# Altium schematic sheet Battery Protection.SchDoc
size A4; SheetNumber: 5; SheetTotal: 6
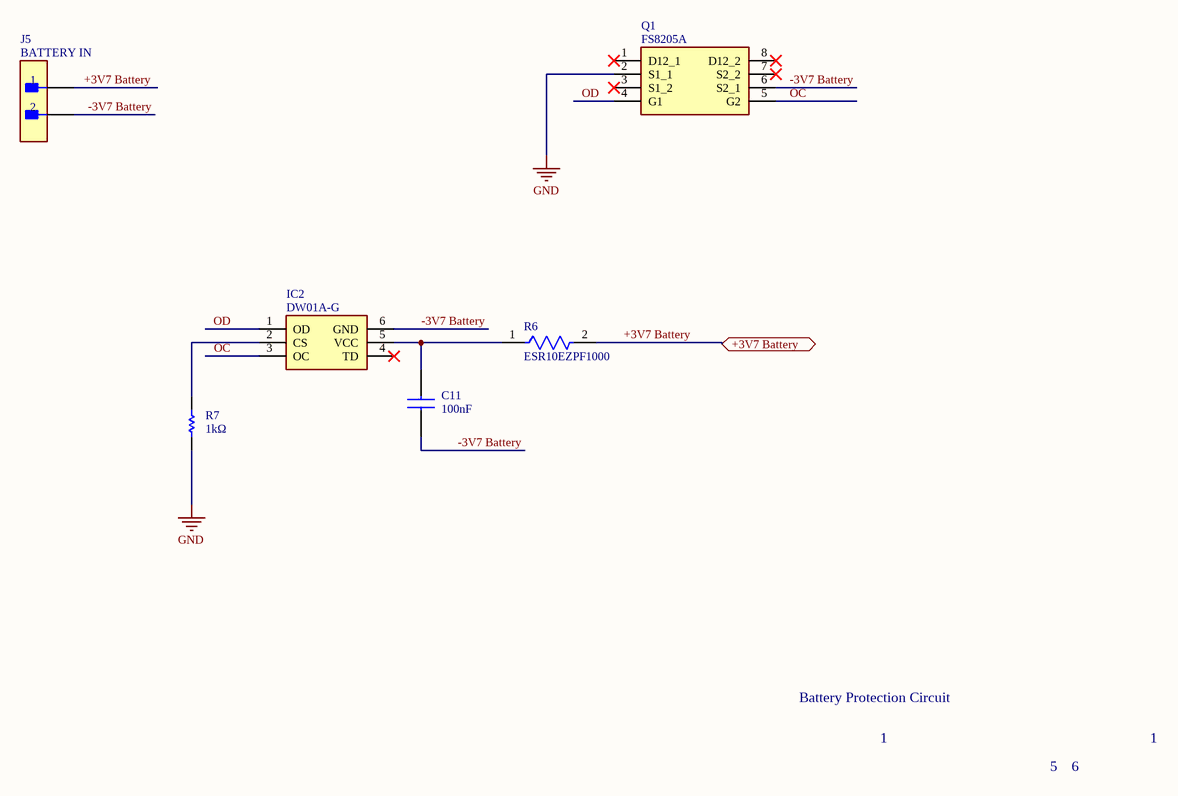
[diagram p0: Battery Protection.SchDoc]

## Parts
C11  value 100nF  [CAPC2013X137N]  (hidden comment: 0805B104K500NT)
IC2  DW01A-G  [SOT95P280X135-6N]
J5  BATTERY IN  [FP-B2B-EH-A_LF_SN-MFG]
Q1  FS8205A  [SOP65P640X120-8N]
R6  ESR10EZPF1000  [FP-ESR10-IPC_C]
R7  value 1kΩ  [RESC2013X60X30ML20T20]  (hidden comment: RK73B2ATTD102J)

## Ports
+3V7 Battery (bidir, see Encode Schematic[1B], Battery Charger[3C], Voltage Regulator[2B])

## Nets
GND: Q1.2(S1_1) R7.1
+3V7 Battery: J5.1 R6.2 ; port +3V7 Battery
-3V7 Battery: C11.2 IC2.6(GND) J5.2 Q1.6(S2_1)
OC: IC2.3(OC) Q1.5(G2)
OD: IC2.1(OD) Q1.4(G1)
NetC11_1: C11.1 IC2.5(VCC) R6.1
NetIC2_2: IC2.2(CS) R7.2

Not connected (* = marked no-connect by the designer): IC2 4(TD)*; Q1 1(D12_1)* 3(S1_2)* 7(S2_2)* 8(D12_2)*

## Notes on the sheet
- Battery Protection Circuit
- 1
- 5
- 6

## Library data of the parts
C11 = 0805B104K500NT: Capacitor; Manufacturer_Name: Novacap; Datasheet Link: https://componentsearchengine.com/Datasheets/1/0805B104K500NT.pdf; Height: 1.37mm; Manufacturer_Part_Number: 0805B104K500NT; Mouser Part Number: 767-0805B104K500NT; Mouser Price/Stock: https://www.mouser.com/Search/Refine.aspx?Keyword=767-0805B104K500NT
IC2 = DW01A-G: Integrated Circuit; Manufacturer_Name: Fortune Semiconductor Corporation; Datasheet Link: http://acoptex.com/uploads/DW01A.pdf; Height: 1.35mm; Manufacturer_Part_Number: DW01A-G
J5 = CMP-17439-000026-1: B2B-EH-A(LF)(SN), CONN HEADER VERT 2POS 2.5MM; Number of Contacts: 2; Current Rating: 3A; Connector Type: Plug; Contact Resistance: 20mR; Gender: Male; Voltage Rating: 250V; Fastening Type: Detent; Depth: 3.8mm; Max Operating Temperature: 85°C; Orientation: Straight; Series: EH; Contact Plating: Tin; Min Operating Temperature: -25°C; Contact Type: Male Pin; Housing Color: White; Termination: Press-Fit; Housing Material: Nylon; Pitch: 2.5mm; Number of Positions: 2; Max Current Rating: 3A; Packaging: Bulk; Lead Free: Lead Free; Number of Rows: 1; Length: 7.5mm; Contact Mating Length: 0.13inch; Color: Natural; Max Voltage Rating (AC): 250V; Contact Material: Copper Alloy; Mount: Through Hole
Q1 = FS8205A: MOSFET (N-Channel); Manufacturer_Name: FSC; Datasheet Link: https://datasheet.lcsc.com/szlcsc/Fortune-Semicon-FS8205A_C16052.pdf; Height: 1.2mm; Manufacturer_Part_Number: FS8205A
R6 = CMP-08839-028189-1: 100Ω ±1% 0.4W 0805 Anti-Surge Chip Resistor AEC-Q200; Resistance: 100R; Max Power Dissipation: 400mW; Temperature Coefficient: 100ppm/°C; Min Operating Temperature: -55°C; Case Code (Metric): 2012; Number of Terminations: 2; Packaging: Tape and Reel; RoHS Compliant: Yes; Max Operating Temperature: 155°C; Features: Automotive AEC-Q200; Series: ESR; Case Code (Imperial): 0805; Resistor Type: Thick Film; Tolerance: 1%; Case/Package: 0805
R7 = CMP-2001-04656-1: Manufacturer: KOA Speer; Part Number: RK73B2ATTD102J